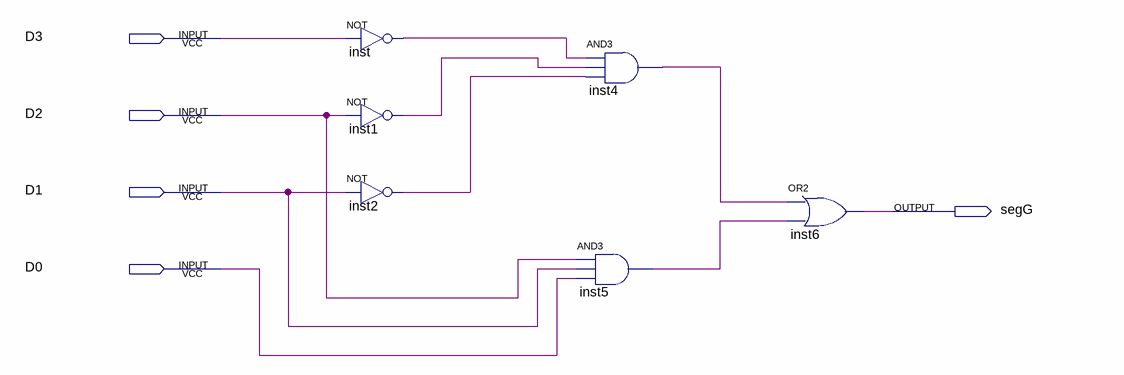
[diagram p0: schematic sheet]
// Quartus schematic segG.bdf as structural Verilog: 6 symbols, 5 pins
module segG (
  input  D3,
  input  D2,
  input  D1,
  input  D0,
  output segG
);

  wire inst1_out, inst2_out, inst4_out, inst5_out, inst_out;

  not inst (inst_out, D3);
  not inst1 (inst1_out, D2);
  not inst2 (inst2_out, D1);
  and inst4 (inst4_out, inst_out, inst1_out, inst2_out);
  and inst5 (inst5_out, D2, D1, D0);
  or inst6 (segG, inst4_out, inst5_out);
endmodule
